# Altium schematic sheet USB_to_UART.SchDoc
size A4; SheetNumber: 8; SheetTotal: 8
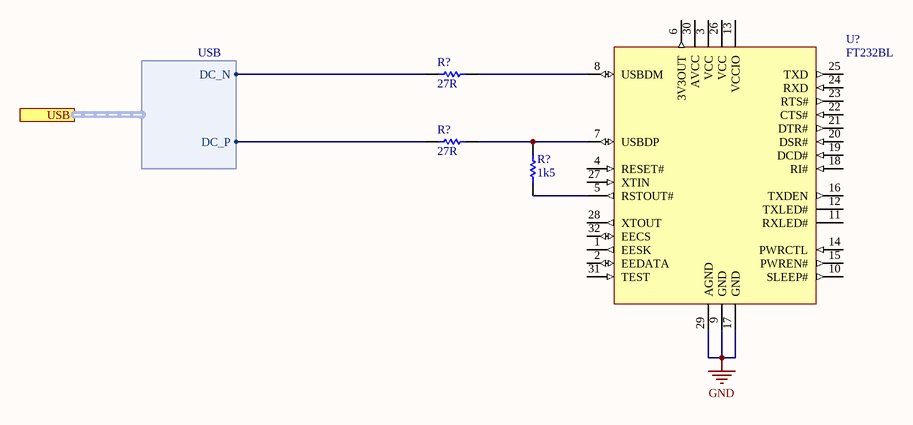
[diagram p0: USB_to_UART.SchDoc]

## Parts
(Parts that share a designator on the sheet are numbered #1, #2 ... from top to bottom, then left to right.)
R?#1  27R
R?#2  27R
R?#3  1k5
U?  FT232BL  [LQFP-32_L]

## Ports
USB (harness USB)

## Harnesses
USB: DC_N, DC_P

## Nets
GND: U?.9(GND) U?.17(GND) U?.29(AGND)
NetR?#1_1: R?#1.1 ; port USB.DC_N
NetR?#1_2: R?#1.2 U?.8(USBDM)
NetR?#2_1: R?#2.1 ; port USB.DC_P
NetR?#2_2: R?#2.2 R?#3.2 U?.7(USBDP)
NetR?#3_1: R?#3.1 U?.5(RSTOUT#)

Not connected (* = marked no-connect by the designer): U? 1(EESK) 2(EEDATA) 3(VCC) 4(RESET#) 6(3V3OUT) 10(SLEEP#) 11(RXLED#) 12(TXLED#) 13(VCCIO) 14(PWRCTL) 15(PWREN#) 16(TXDEN) 18(RI#) 19(DCD#) 20(DSR#) 21(DTR#) 22(CTS#) 23(RTS#) 24(RXD) 25(TXD) 26(VCC) 27(XTIN) 28(XTOUT) 30(AVCC) 31(TEST) 32(EECS)

## Library data of the parts
R?#1 R?#2 = 27R: Resistor; Published: 8-Jun-2000; LatestRevisionDate: 17-Jul-2002; LatestRevisionNote: Re-released for DXP Platform.; PackageReference: AXIAL-0.3; Publisher: Altium Limited; PackageDescription: Axial Device, Thru-Hole; 2 Leads; 0.3 in Pin Spacing
R?#3 = 1k5: Resistor; Published: 8-Jun-2000; LatestRevisionDate: 17-Jul-2002; LatestRevisionNote: Re-released for DXP Platform.; PackageReference: AXIAL-0.3; Publisher: Altium Limited; PackageDescription: Axial Device, Thru-Hole; 2 Leads; 0.3 in Pin Spacing
U? = CMP-0078-00024-3: USB UART Asynchronous Serial Data Transfer Chip, 0 to +70 degC, 32-pin LQFP, Pb-Free; Manufacturer: FTDI; DatasheetVersion: ver 2.2, Nov-2011; ComponentLink2URL: http://www.ftdichip.com/Support/Documents/DataSheets/ICs/DS_FT232BL_BQ.pdf; ComponentLink1Description: Manufacturer URL; PackageVersion: Nov-11; PackageDescription: 32-Pin Thin Quad Flat Pack, 7 x 7 mm Body, 0.8 mm Pitch; PackageReference: LQFP-32; PartNumber: FT232BL; ComponentLink2Description: Datasheet; ComponentLink1URL: http://www.ftdichip.com/